# EAGLE design JouleThief (EAGLE 4.11)
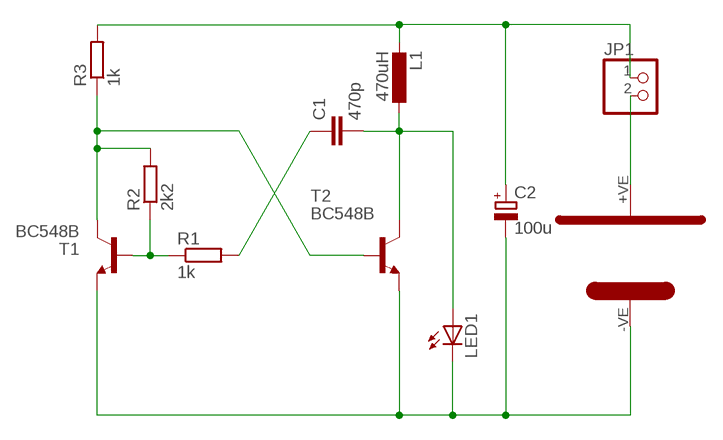
[diagram p0: schematic, sheet 1]

## Parts
C1  470p  C-EU050-030X075  [C050-030X075]
C2  100u  CPOL-EUE5-5  [E5-5]
JP1  PINHD-1X2  [1X02]
L1  470uH  DO3316P  [DO3316P]
LED1  LED5MM  [LED5MM]
R1  1k  R-EU_0204/7  [0204/7]
R2  2k2  R-EU_0204/7  [0204/7]
R3  1k  R-EU_0204/7  [0204/7]
T1  BC548B  BC548C-NPN-TO92-EBC  [TO92-EBC]
T2  BC548B  BC548C-NPN-TO92-EBC  [TO92-EBC]
U$1  AA_1CELL_HOLDER  [AA_1CELL_HOLDER]

## Nets
N$1: C2.- LED1.K(C) T1.E T2.E U$1.-VE
N$2: R1.1 R2.1 T1.B
N$3: R2.2 R3.1 T1.C T2.B
N$4: C1.1 R1.2
N$5: JP1.2 U$1.+VE
N$6: C2.+ JP1.1 L1.1 R3.2
N$7: C1.2 L1.2 LED1.A T2.C

## Library data of the parts
C1 = rcl:C-EU: CAPACITOR, European symbol
C2 = rcl:CPOL-EU: POLARIZED CAPACITOR, European symbol
JP1 = pinhead:PINHD-1X2: PIN HEADER
L1 = WE_PD4_inductor:DO3316P: COILCRAFT
LED1 = led:LED: LED OSRAM: - CHIPLED LG R971, LG N971, LY N971, LG Q971, LY Q971, LO R971, LY R971 LH N974, LH R974 LS Q976, LO Q976, LY Q976 LO Q996 - Hyper CHIPLED LW Q18S LB Q993, LB Q99A, LB R99A - SideLED LS A670, LO A670, LY A670, LG A670, LP A670 LB A673, LV A673, LT A673, LW A673 LH A674 LY A675 LS A676, LA A676, LO A676, LY A676, LW A676 LS A679, LY A679, LG A679 - Hyper Micro SIDELED® LS Y876, LA Y876, LO Y876, LY Y876 LT Y87S - SmartLED LW L88C, LW L88S LB L89C, LB L89S, LG L890 LS L89K, LO L89K, LY L89K LS L896, LA L896, LO L896, LY L896 - TOPLED LS T670, LO T670, LY T670, LG T670, LP T670 LSG T670, LSP T670, LSY T670, LOP T670, LYG T670 LG T671, LOG T671, LSG T671 LB T673, LV T673, LT T673, LW T673 LH T674 LS T676, LA T676, LO T676, LY T676, LB T676, LH T676, LSB T676, LW T676 LB T67C, LV T67C, LT T67C, LS T67K, LO T67K, LY T67K, LW E67C LS E67B, LA E67B, LO E67B, LY E67B, LB E67C, LV E67C, LT E67C LW T67C LS T679, LY T679, LG T679 LS T770, LO T770, LY T770, LG T770, LP T770 LB T773, LV T773, LT T773, LW T773 LH T774 LS E675, LA E675, LY E675, LS T675 LS T776, LA T776, LO T776, LY T776, LB T776 LHGB T686 LT T68C, LB T68C - Hyper Mini TOPLED® LB M676 - Mini TOPLED Santana® LG M470 LS M47K, LO M47K, LY M47K Source: http://www.osram.convergy.de/
R1-R3 = rcl:R-EU_: RESISTOR, European symbol
T1 T2 = transistor:*-NPN-: NPN Transistror
U$1 = battery:AA_1CELL_HOLDER

## Board
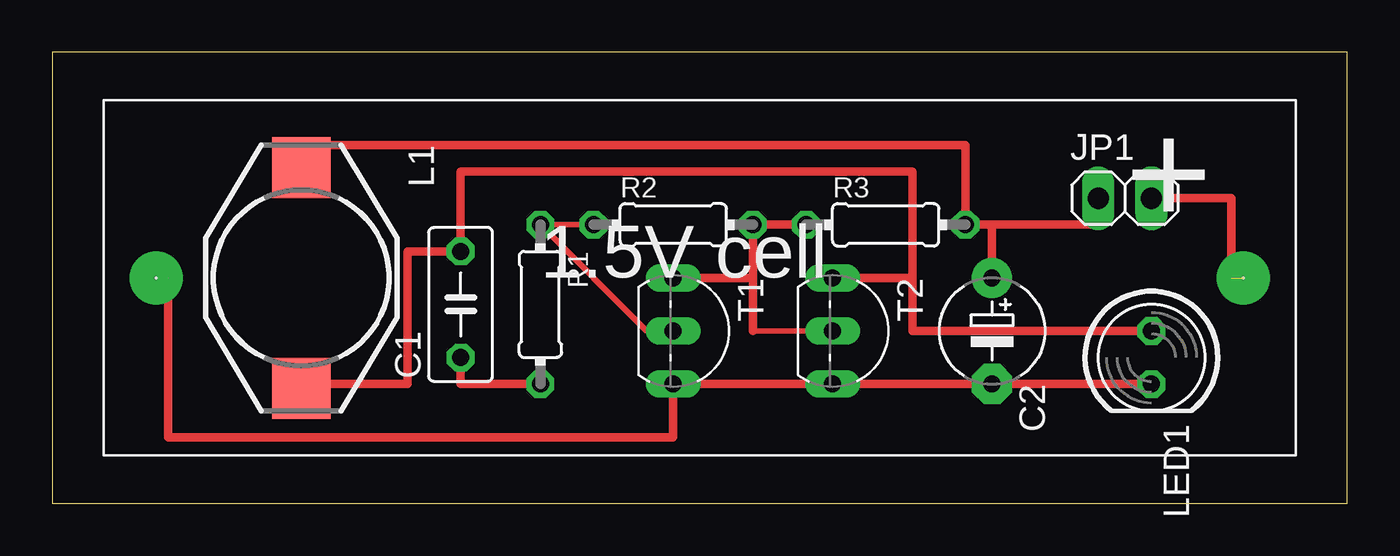
[diagram p1: board, top side]
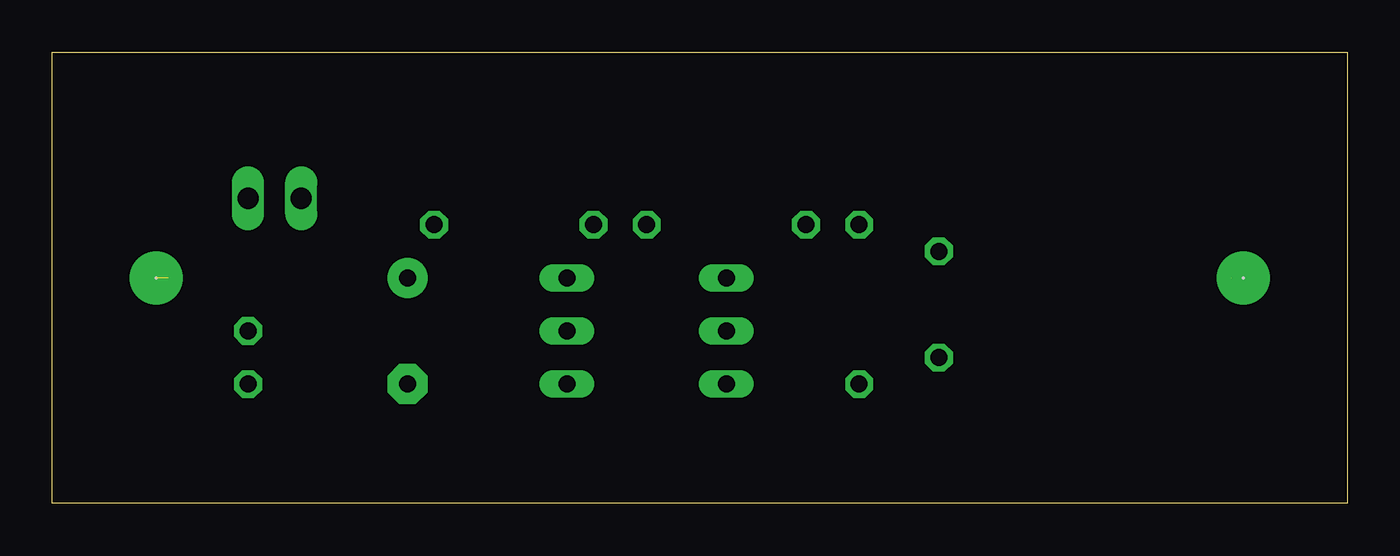
[diagram p2: board, bottom side, seen from below]

Size 61.9 x 21.58 mm. Coordinates in mm from the lower left corner, seen from the top.
Outline: 0,0 61.9,0 61.9,21.58 0,21.58 0,0
Copper layers (1*16): Top 0.035mm / dielectric 1.5mm / Bottom 0.035mm
Design rules "default": minimum track width 10mil, minimum drill 24mil, track to track 8mil, track to pad 8mil, pad to pad 8mil, via to via 8mil, smd to smd 8mil, copper to edge 40mil, drill to drill 8mil, minimum pad ring 10mil, minimum via ring 8mil, stop-mask expansion 4mil, vias tented up to drill 0mil, thermal gap 10mil

### Footprints (pad centres in the part's own frame; a part is rotated, then mirrored left to right if it is on the bottom)
C050-030X075 = drill 0.813 octagon: 1 -2.54,0; 2 2.54,0
E5-5 = drill 0.813 pad 1.905 round: + -2.54,0 | drill 0.813 pad 1.905 octagon: - 2.54,0
1X02 = drill 1.016 long: 1 -1.27,0; 2 1.27,0
DO3316P = smd 2.92 x 2.79: 1 -5.28,0; 2 5.28,0
LED5MM = drill 0.813 octagon: A -1.27,0; K 1.27,0
0204/7 = drill 0.813 octagon: 1 -3.81,0; 2 3.81,0
TO92-EBC = drill 0.813 long: B 0,-1.27; C -2.54,-1.27; E 2.54,-1.27
AA_1CELL_HOLDER = drill 0.039 pad 2.54 round: +VE 25.99,0; -VE -25.99,0 | hole 0.039: -25.99,0; 25.99,0

### Placement (x,y rotation side)
C1  19.52,9.52 90 top
C2  44.92,8.25 270 top
JP1  51.27,14.6 0 top
L1  11.9,10.79 270 top
LED1  52.54,6.98 270 top
R1  23.33,9.52 270 top
R2  29.68,13.33 0 top
R3  39.84,13.33 0 top
T1  30.95,8.25 270 top
T2  38.57,8.25 270 top
U$1  30.95,10.79 0 top

### Tracks (layer width: path | path; a pad name or v marks a point on that pad's centre or on a via)
N$1  (1 unrouted)
  Top 0.406: 5.55,10.79 5.55,3.17 29.68,3.17 T1.E T2.E C2.- LED1.K
  Bottom 0.406: U$1.-VE 5.55,10.79
N$2
  Top 0.254: R2.1 R1.1 28.41,8.25 T1.B
N$3
  Top 0.254: 33.49,8.25 T2.B
  Top 0.406: T1.C 33.49,10.79 | 33.49,10.79 33.49,8.25 | 33.49,10.79 R2.2 R3.1
N$4
  Top 0.406: C1.1 19.52,5.71 R1.2
N$5  (1 unrouted)
  Top 0.406: JP1.2 56.35,14.6 56.35,10.79 57.62,10.79
N$6
  Top 0.254: L1.1 13.17,17.14
  Top 0.406: 44.92,13.33 C2.+ | 11.9,15.87 L1.1 11.9,17.14 43.65,17.14 R3.2 44.92,13.33 | 44.92,13.33 50,13.33 JP1.1
N$7
  Top 0.254: L1.2 13.17,5.71
  Top 0.406: 41.11,10.79 41.11,8.25 LED1.A | 41.11,10.79 41.11,15.87 19.52,15.87 C1.2 16.98,12.06 16.98,5.71 13.17,5.71 | 41.11,10.79 T2.C